# EasyEDA schematic 1-Schematic_LoPoSwitchWiFI.json
TITLE: LowPoSwitch_WiFi; REV: 2.2; Date: 2018-11-04; Sheet: 1/1; Drawn By: mikmak
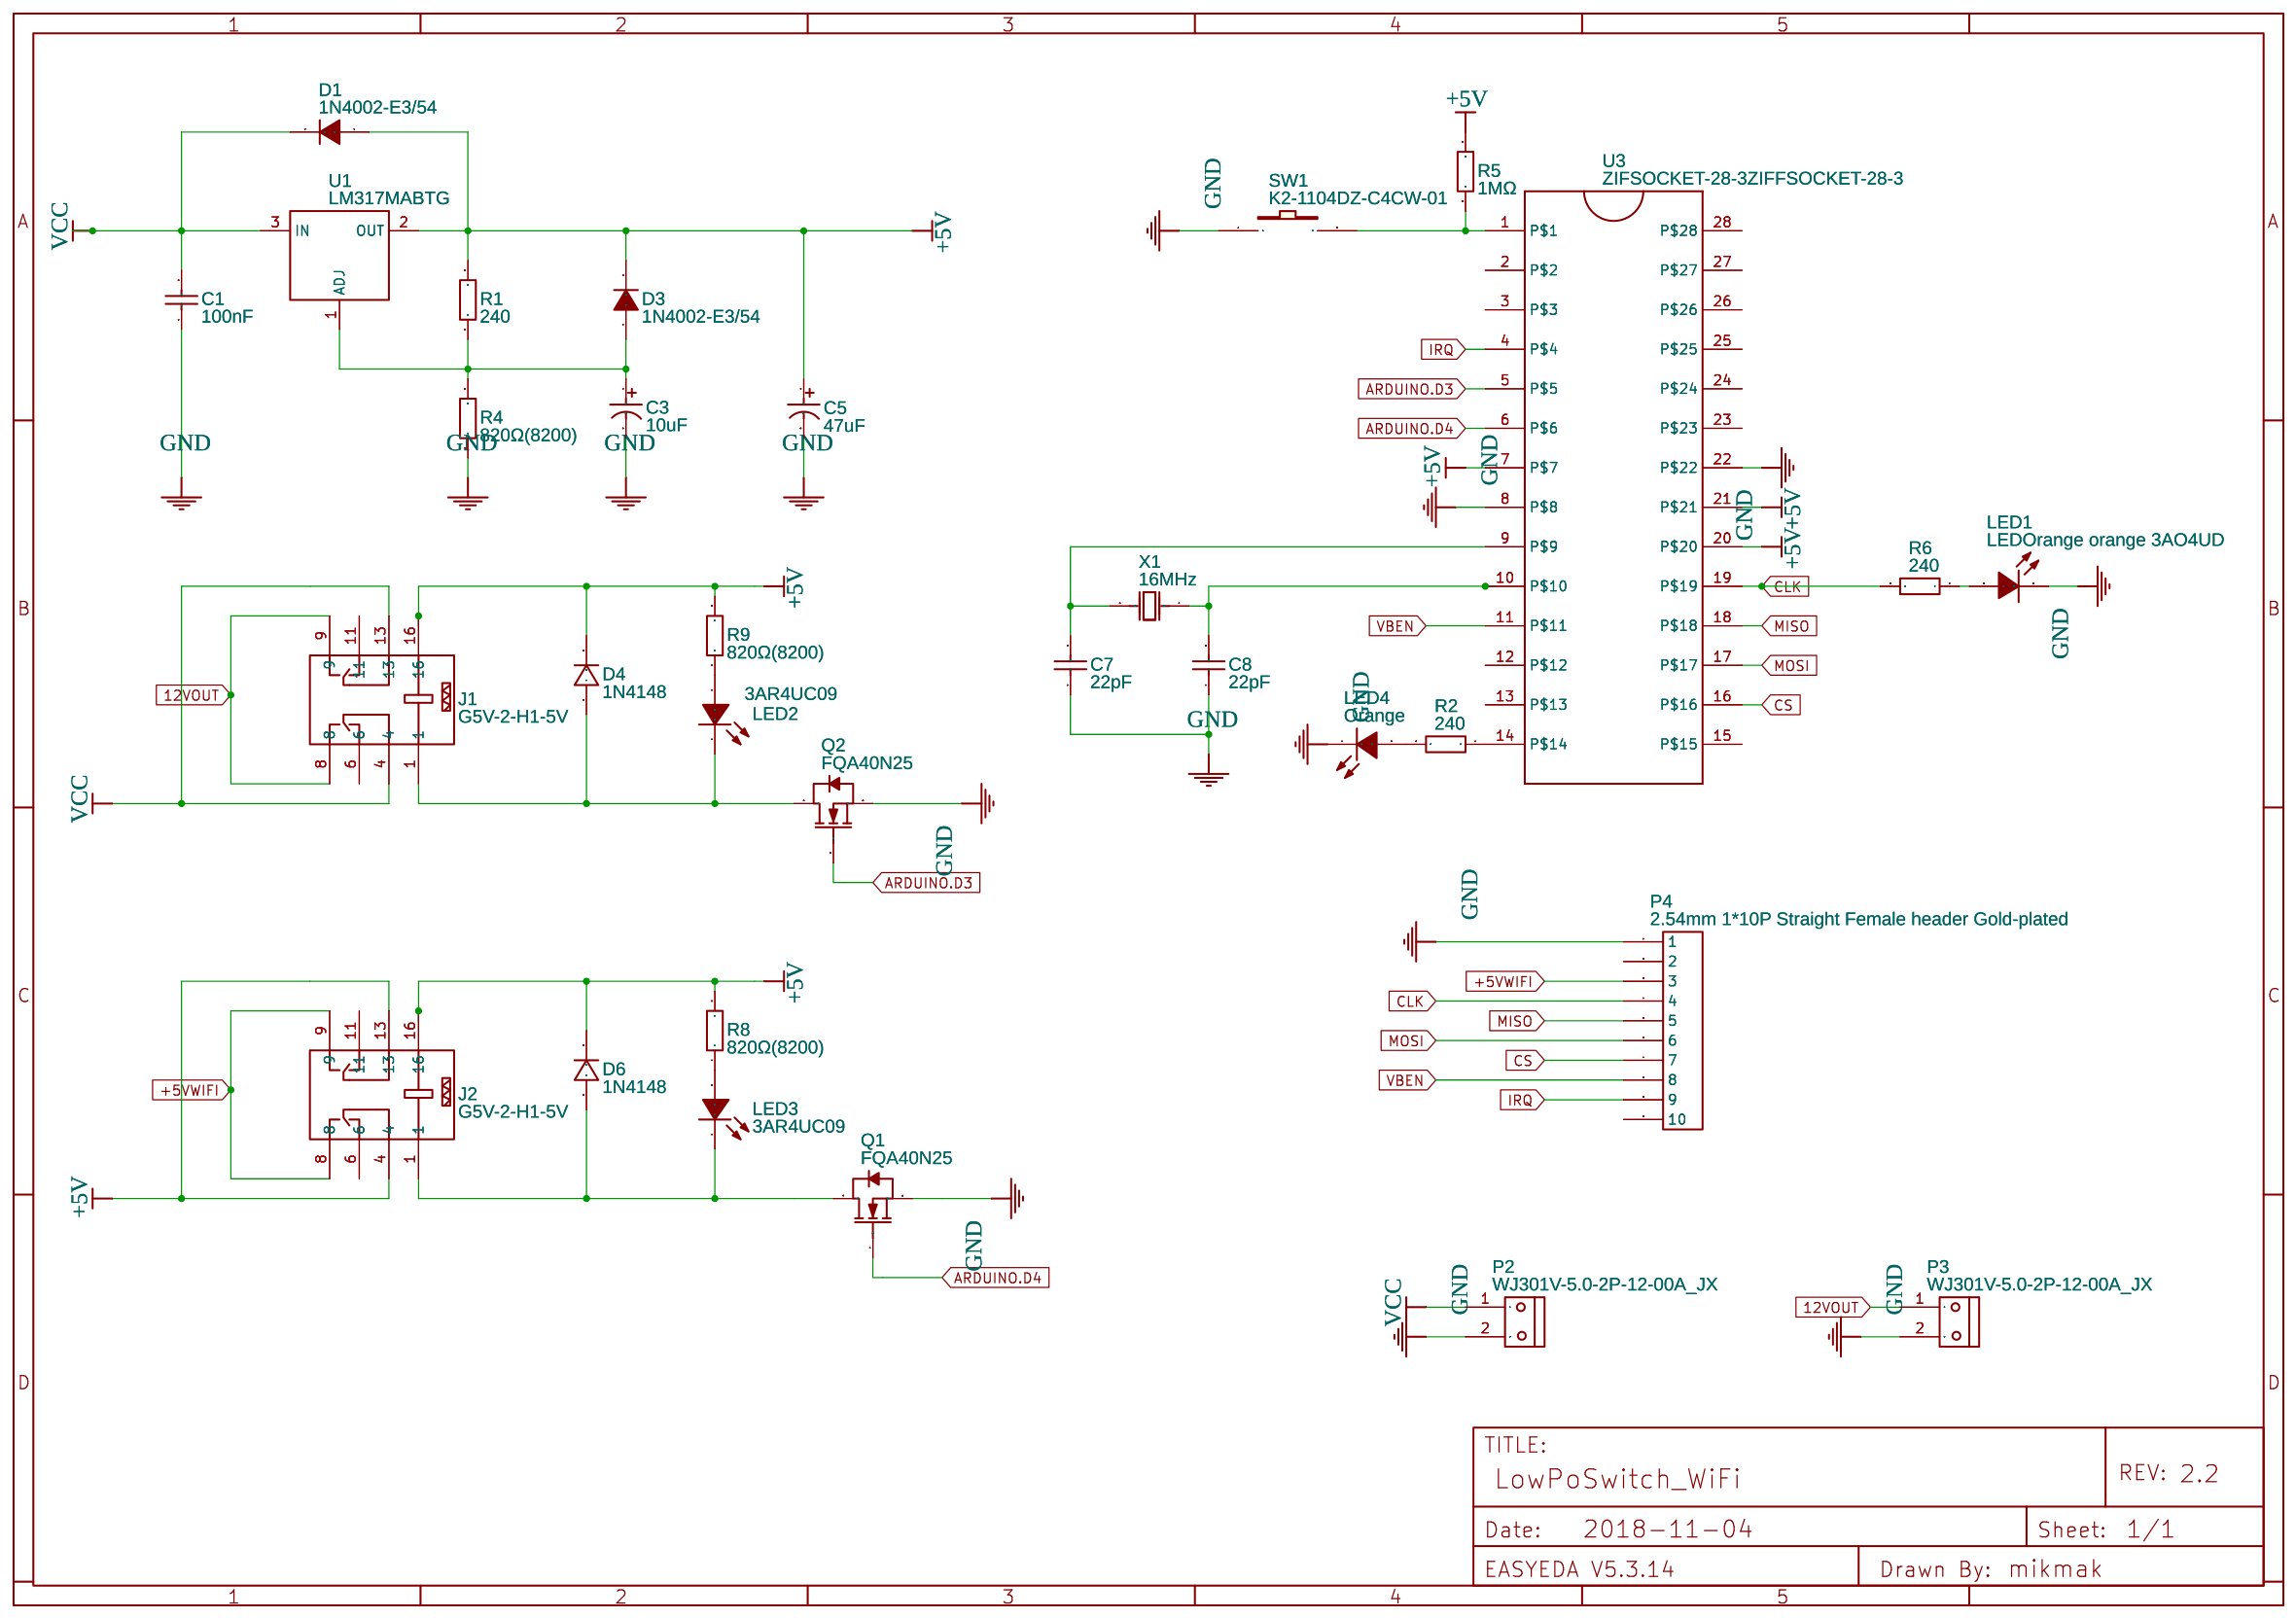
[diagram p0: schematic sheet]

## Parts
C1  100nF  [CAP-CBB-13.0*5.0]
C3  10uF  [CAP-D6.3XF2.5]
C5  47uF  [CAP-D5.0XF2.0]
C7  22pF  [RAD-0.2]
C8  22pF  [RAD-0.2]
D1  1N4002-E3/54  [DO-41]
D3  1N4002-E3/54  [DO-41]
D4  1N4148  [DO-35G]
D6  1N4148  [DO-35G]
J1  G5V-2-H1-5V  [G5V-2-H1-5V]
J2  G5V-2-H1-5V  [G5V-2-H1-5V]
LED1  LEDOrange orange 3AO4UD  [LED-3MM]
LED2  3AR4UC09  [LED-3MM]
LED3  3AR4UC09  [LED-3MM]
LED4  Orange  [LED-3MM]
P2  WJ301V-5.0-2P-12-00A_JX  [WJ301V-5.0-2P-12-00A_JX]
P3  WJ301V-5.0-2P-12-00A_JX  [WJ301V-5.0-2P-12-00A_JX]
P4  2.54mm 1*10P Straight Female header Gold-plated  [HDR-10X1/2.54]
Q1  FQA40N25  [TO-3P]
Q2  FQA40N25  [TO-3P]
R1  240  [AXIAL-0.3]
R2  240  [AXIAL-0.3]
R4  820Ω(8200)  [AXIAL-0.3]
R5  1MΩ  [AXIAL-0.4]
R6  240  [AXIAL-0.3]
R8  820Ω(8200)  [AXIAL-0.3]
R9  820Ω(8200)  [AXIAL-0.3]
SW1  K2-1104DZ-C4CW-01  [KEY-6.0*6.0-4]
U1  LM317MABTG  [TO-220(TO-220-3)]
U3  ZIFSOCKET-28-3ZIFFSOCKET-28-3  [DIL28-3-ZIF_SOCKET]
X1  16MHz  [OSC-49S-1]

## Library data of the parts
C1 = MPP104K5130508LC: Supplier: LCSC; Manufacturer: SRD; Tolerance: ±10%; Supplier Part: C109523
C3 = 10uf/100V: Supplier: LCSC; Manufacturer: ValuePro; Rated Voltage: 100V; Tolerance: ±20%; Supplier Part: C2029
C5 = 47UF16V: Supplier: LCSC; Manufacturer: ValuePro; Supplier Part: C30224
C7 C8 = Monolithic0603N220J500: Supplier: LCSC; Manufacturer: FH; Rated Voltage: 50V; Tolerance: ±5%; Supplier Part: C110283
D1 D3 = -: Supplier: LCSC; Manufacturer: VISHAY; image: //image.lceda.cn/szlcsc/C33504.jpg; Supplier Part: C33504
D4 D6 = -: Supplier Part: C163750; Supplier: LCSC; Manufacturer: FMS; Contributor: LCSC
J1 J2 = -: Supplier: LCSC; Manufacturer: OMRON; image: //image.lceda.cn/szlcsc/C28066.jpg; Supplier Part: C28066
LED1 = -: Supplier: LCSC; Manufacturer: KENTO; image: //image.lceda.cn/szlcsc/C62095.jpg; Supplier Part: C62095
LED2 LED3 = -: Supplier: LCSC; Manufacturer: KENTO; image: //image.lceda.cn/szlcsc/C6211.jpg; Supplier Part: C6211
LED4 = -: Supplier: LCSC; Manufacturer: KENTO; Manufacturer Part: LEDOrange orange 3AO4UD; image: //image.lceda.cn/szlcsc/C62095.jpg; Supplier Part: C62095
P2 P3 = -: Contributor: PatternAgents; Supplier: EasyEDA; Manufacturer Part: ?; Supplier Part: C72326
P4 = -: Supplier: LCSC; Manufacturer: BOOMELE; Supplier Part: C35445
Q1 Q2 = -: Supplier: LCSC; Manufacturer: FAIRCHILD; Supplier Part: C10877
R1 R2 R6 = MF1/8W-240Ω±1% T52: Supplier: LCSC; Manufacturer: CCO; Power (Watts): 1/8W; Tolerance: ±1%; Supplier Part: C119165
R4 R8 R9 = MF1/8W-820Ω±1% T52: Supplier: LCSC; Manufacturer: CCO; Contributor: LCSC; Supplier Part: C119177
R5 = MFR0W4F1004A50: Supplier: LCSC; Manufacturer: UniOhm; Power (Watts): 1/4W; Tolerance: ±1%; Supplier Part: C58596
SW1 = -: Supplier: LCSC; Manufacturer: HRO; Contributor: LCSC; Supplier Part: C145889
U1 = -: Supplier: LCSC; Manufacturer: ON; Supplier Part: C94823
U3 = -: Lever-action ZIF socket for 28-pin ICs; Contributor: SparkFun; Manufacturer Part: ?
X1 = X49SD16MSD2SC: Supplier: LCSC; Manufacturer: YXC; Frequency Tolerance: ±20ppm; Supplier Part: C16212

## Nets
12VOUT: J1.8 J1.9 P3.1
+5V: C5.1 D1.1(A) D3.2(K) D4.2 D6.2 J1.16 J2.4 J2.13 J2.16 R1.2 R5.2 R8.2 R9.2 U1.2(OUT) U3.7(P$7) U3.20(P$20) U3.21(P$21)
+5VWIFI: J2.8 J2.9 P4.3
GND: C1.1 C3.2 C5.2 C7.1 C8.1 LED1.1(K) LED4.1(K) P2.2 P3.2 P4.1 Q1.3(S) Q2.3(S) R4.1 SW1.1 U3.8(P$8) U3.22(P$22)
VCC: C1.2 D1.2(K) J1.4 J1.13 P2.1 U1.3(IN)
ARDUINO.D3: Q2.1(G) U3.5(P$5)
ARDUINO.D4: Q1.1(G) U3.6(P$6)
CLK: P4.4 R6.2 U3.19(P$19)
CS: P4.7 U3.16(P$16)
IRQ: P4.9 U3.4(P$4)
MISO: P4.5 U3.18(P$18)
MOSI: P4.6 U3.17(P$17)
VBEN: P4.8 U3.11(P$11)
Net-(C3-1): C3.1 D3.1(A) R1.1 R4.2 U1.1(ADJ)
Net-(C7-2): C7.2 U3.9(P$9) X1.2(OSC2)
Net-(C8-2): C8.2 U3.10(P$10) X1.1(OSC1)
Net-(D4-1): D4.1 J1.1 LED2.1(K) Q2.2(D)
Net-(D6-1): D6.1 J2.1 LED3.1(K) Q1.2(D)
Net-(LED1-2): LED1.2(A) R6.1
Net-(LED2-2): LED2.2(A) R9.1
Net-(LED3-2): LED3.2(A) R8.1
Net-(LED4-2): LED4.2(A) R2.2
Net-(R2-1): R2.1 U3.14(P$14)
Net-(R5-1): R5.1 SW1.2 U3.1(P$1)

Not connected (* = marked no-connect by the designer): J1 6 11; J2 6 11; P4 2 10; U3 2(P$2) 3(P$3) 12(P$12) 13(P$13) 15(P$15) 23(P$23) 24(P$24) 25(P$25) 26(P$26) 27(P$27) 28(P$28)
